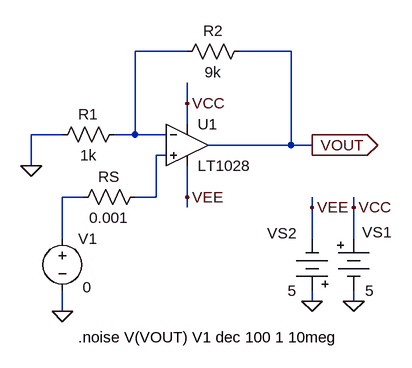
[diagram p0: schematic fig-03-02-13.asc]
fig-03-02-13.asc, the LTspice schematic file:
Version 4
SHEET 1 880 680
WIRE 208 32 128 32
WIRE 368 32 288 32
WIRE 208 112 208 80
WIRE 208 144 208 112
WIRE 16 160 -32 160
WIRE 128 160 128 32
WIRE 128 160 96 160
WIRE 176 160 128 160
WIRE 368 176 368 32
WIRE 368 176 240 176
WIRE 400 176 368 176
WIRE 176 192 160 192
WIRE -32 208 -32 160
WIRE 48 256 16 256
WIRE 160 256 160 192
WIRE 160 256 128 256
WIRE 208 256 208 208
WIRE 208 272 208 256
WIRE 400 272 400 256
WIRE 464 272 464 256
WIRE 16 320 16 256
WIRE 400 320 400 272
WIRE 464 320 464 272
WIRE 400 416 400 400
WIRE 464 416 464 400
WIRE 16 432 16 400
FLAG 16 432 0
FLAG 400 176 VOUT
IOPIN 400 176 Out
FLAG 400 416 0
FLAG 464 416 0
FLAG 400 272 VEE
FLAG 464 272 VCC
FLAG 208 112 VCC
FLAG 208 256 VEE
FLAG -32 208 0
SYMBOL res 304 16 R90
WINDOW 0 0 56 VBottom 2
WINDOW 3 32 56 VTop 2
SYMATTR InstName R2
SYMATTR Value 9k
SYMBOL Misc\\battery 464 304 R0
WINDOW 0 13 6 Left 2
WINDOW 3 18 96 Left 2
WINDOW 123 0 0 Left 0
WINDOW 39 0 0 Left 0
SYMATTR InstName VS1
SYMATTR Value 5
SYMBOL Misc\\battery 400 416 R180
WINDOW 0 24 104 Left 2
WINDOW 3 24 16 Left 2
WINDOW 123 0 0 Left 0
WINDOW 39 0 0 Left 0
SYMATTR InstName VS2
SYMATTR Value 5
SYMBOL res 112 144 R90
WINDOW 0 0 56 VBottom 2
WINDOW 3 32 56 VTop 2
SYMATTR InstName R1
SYMATTR Value 1k
SYMBOL voltage 16 304 R0
WINDOW 3 31 91 Left 2
WINDOW 123 0 0 Left 0
WINDOW 39 0 0 Left 0
SYMATTR Value 0
SYMATTR InstName V1
SYMBOL Opamps\\LT1028 208 112 R0
SYMATTR InstName U1
SYMBOL res 144 240 R90
WINDOW 0 0 56 VBottom 2
WINDOW 3 32 56 VTop 2
SYMATTR InstName RS
SYMATTR Value 0.001
TEXT 40 472 Left 2 !.noise V(VOUT) V1 dec 100 1 10meg

The netlist it stands for:
* fig-03-02-13.asc
R2 VOUT N001 9k
VS1 VCC 0 5
VS2 0 VEE 5
R1 N001 0 1k
V1 N003 0 0
XU1 N002 N001 VCC VEE VOUT LT1028  ; pins In+ In- V+ V- OUT
RS N002 N003 0.001
.noise V(VOUT) V1 dec 100 1 10meg
.lib LTC.lib
.backanno
.end